# EAGLE design sdo_to_quiic_qt (EAGLE 9.5.2)
COMPANY: ADAFRUIT INDUSTRIES; DRAWN: KTOWN; REV: A
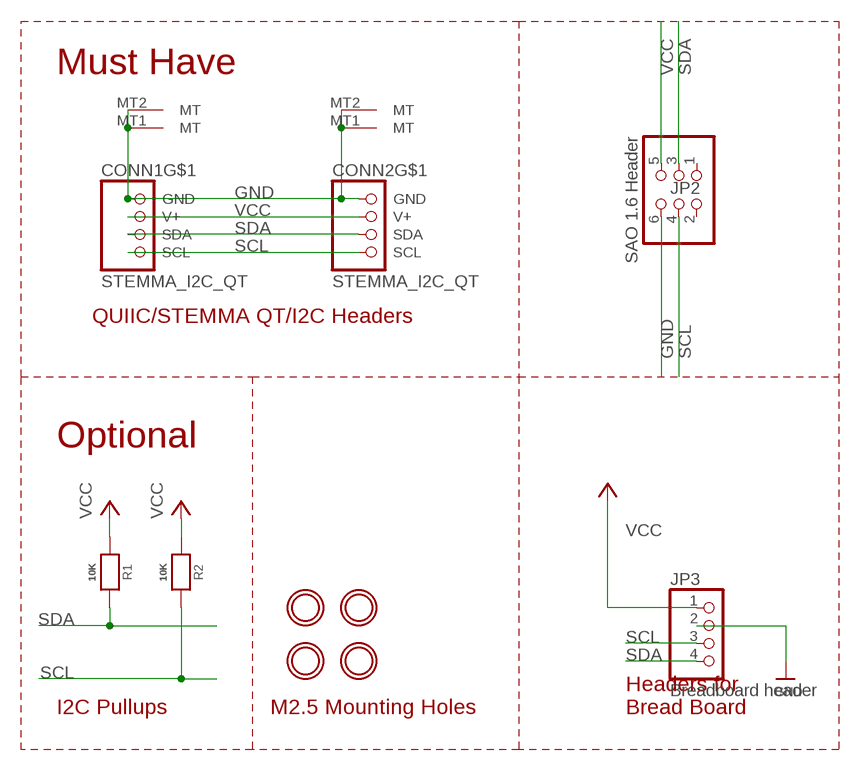
[diagram p0: schematic, sheet 1]

## Parts
CONN1  STEMMA_I2C_QT  [JST_SH4]
CONN2  STEMMA_I2C_QT  [JST_SH4]
JP2  SAO 1.6 Header  HEADER-2X3  [2X03_ROUND_70MIL]
JP3  Breadboard header  HEADER-1X4ROUND  [1X04_ROUND]
R1  10K  RESISTOR0805_NOOUTLINE  [0805-NO]
R2  10K  RESISTOR0805_NOOUTLINE  [0805-NO]
U$1  MOUNTINGHOLE2.5  [MOUNTINGHOLE_2.5_PLATED]
U$17  MOUNTINGHOLE2.5  [MOUNTINGHOLE_2.5_PLATED]
U$19  MOUNTINGHOLE2.5  [MOUNTINGHOLE_2.5_PLATED]
U$21  MOUNTINGHOLE2.5  [MOUNTINGHOLE_2.5_PLATED]

## Nets
GND [highpower]: CONN1.1(GND) CONN1.MT1(MT) CONN1.MT2(MT) CONN2.1(GND) CONN2.MT1(MT) CONN2.MT2(MT) JP2.6 JP3.2
SCL: CONN1.4(SCL) CONN2.4(SCL) JP2.4 JP3.3 R2.2
SDA: CONN1.3(SDA) CONN2.3(SDA) JP2.3 JP3.4 R1.2
VCC [highpower]: CONN1.2(V+) CONN2.2(V+) JP2.5 JP3.1 R1.1 R2.1
Unconnected: JP2.1 JP2.2

## Notes on the sheet
- Must Have
- QUIIC/STEMMA QT/I2C Headers
- Optional
- I2C Pullups | M2.5 Mounting Holes
- Headers for
  Bread Board

## Library data of the parts
CONN1 CONN2 = microbuilder:STEMMA_I2C
JP2 = microbuilder:HEADER-2X3: PIN HEADER
JP3 = microbuilder:HEADER-1X4: PIN HEADER
R1 R2 = microbuilder:RESISTOR: Resistors For new designs, use the packages preceded by an '_' character since they are more reliable: The following footprints should be used on most boards: _0402 - Standard footprint for regular board layouts _0603 - Standard footprint for regular board layouts _0805 - Standard footprint for regular board layouts _1206 - Standard footprint for regular board layouts For extremely tight-pitch boards where space is at a premium, the following 'micro-pitch' footprints can be used (smaller pads, no silkscreen outline, etc.): _0402MP - Micro-pitch footprint for very dense/compact boards _0603MP - Micro-pitch footprint for very dense/compact boards _0805MP - Micro-pitch footprint for very dense/compact boards _1206MP - Micro-pitch footprint for very dense/compact boards
U$1 U$17 U$19 U$21 = microbuilder:MOUNTINGHOLE: Mounting Hole For #2 screws (0.086"/2.18mm width, 0.094"/2.4mm hole) use 2.5mm; BOM: EXCLUDE

## Net classes
1 highpower: width 0.305 mm, drill 0.483 mm
2 lowpower: width 0.254 mm, drill 0.483 mm

## Board
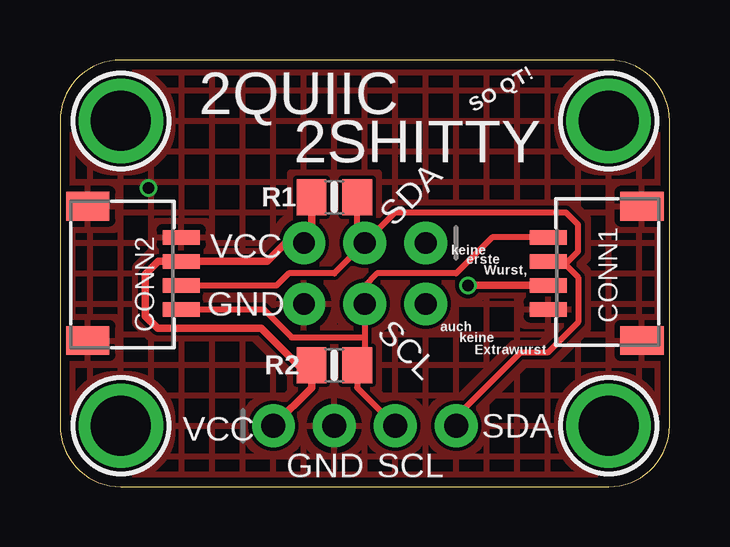
[diagram p1: board, top side]
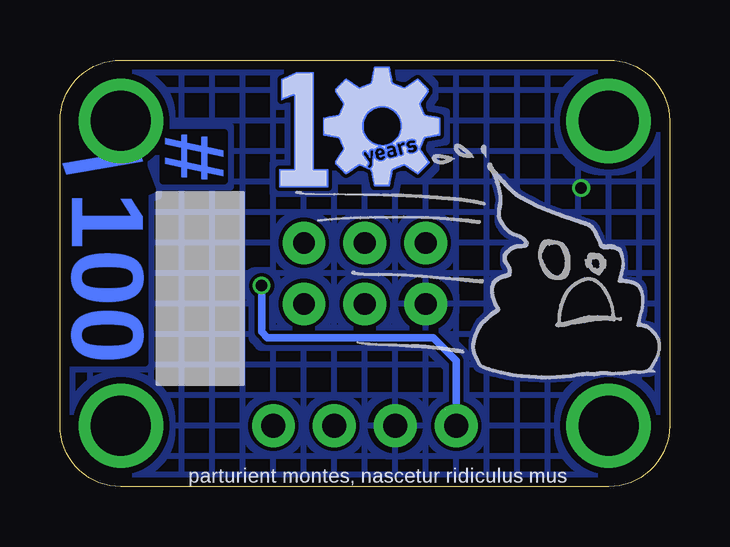
[diagram p2: board, bottom side, seen from below]

Size 25.4 x 17.78 mm. Coordinates in mm from the lower left corner, seen from the top.
Outline: 0,15.24 0,2.54 arc90 2.54,0 22.86,0 arc90 25.4,2.54 25.4,15.24 arc90 22.86,17.78 2.54,17.78 arc90 0,15.24
Copper layers (1*16): Top 0.035559375mm / dielectric 1.6mm / Bottom 0.035559375mm
Design rules "oshpark-2layer-tented": minimum track width 6mil, minimum drill 10mil, track to track 6mil, track to pad 6mil, pad to pad 6mil, via to via 6mil, smd to smd 6mil, copper to edge 15mil, drill to drill 6mil, minimum pad ring 5mil, minimum via ring 5mil, stop-mask expansion 2.5mil, vias tented up to drill 20mil, thermal gap 10mil
bRestrict: area 5,4.6 to 5,4.6; area 5,4.6 to 5.1,4.6; area 5.1,4.6 to 5.1,4.6; area 5.1,4.6 to 5.1,4.6; area 5.2,4.6 to 5.2,4.6; area 4.8,4.6 to 5.3,4.6; area 4.7,4.6 to 4.7,4.6; area 4.7,4.6 to 4.7,4.6; area 4.7,4.6 to 5.3,4.6; area 5.3,4.6 to 5.5,4.6; area 4.6,4.6 to 4.6,4.6; area 4.6,4.6 to 5.6,4.6; 2133 more areas

### Footprints (pad centres in the part's own frame; a part is rotated, then mirrored left to right if it is on the bottom)
JST_SH4 = smd 0.6 x 1.55: 1 -1.5,2.514; 2 -0.5,2.514; 3 0.5,2.514; 4 1.5,2.514 | smd 1.2 x 1.8: MT1 -2.8,-1.386; MT2 2.8,-1.386
2X03_ROUND_70MIL = drill 0.9 pad 1.778: 1 -2.54,-1.27; 2 -2.54,1.27; 3 0,-1.27; 4 0,1.27; 5 2.54,-1.27; 6 2.54,1.27
1X04_ROUND = drill 1 pad 1.778: 1 -3.81,0; 2 -1.27,0; 3 1.27,0; 4 3.81,0
0805-NO = smd 1.24 x 1.5: 1 -0.95,0; 2 0.95,0
MOUNTINGHOLE_2.5_PLATED = drill 2.5 pad 3.2: P$1 0,0

### Placement (x,y rotation side)
CONN1  22.86,8.89 90 top
CONN2  2.54,8.89 270 top
JP2  12.7,8.89 180 top
JP3  12.7,2.54 0 top
R1  11.43,12.06 0 top
R2  11.43,5.06 0 top
U$1  2.54,15.24 0 top
U$17  22.86,15.24 0 top
U$19  2.54,2.54 0 top
U$21  22.86,2.54 0 top

### Tracks (layer width: path | path; a pad name or v marks a point on that pad's centre or on a via)
GND  (via drill 0.48)
  other vias: 3.68,12.45
  pour Top (hatched): 0,17.78 25.4,17.78 25.4,0 0,0
  pour Bottom (hatched): 25.4,15.24 25.4,2.54 arc-90 22.86,0 2.54,0 arc-90 0,2.54 0,15.24 arc-90 2.54,17.78 22.86,17.78 arc-90
SCL
  Top 0.254: 12.7,6.22 JP2.4 12.7,8.38 13.21,8.89 16.51,8.89 18.01,10.39 CONN1.4 | 12.7,6.22 12.7,5.27 R2.2 12.38,4.13 JP3.3 | CONN2.4 8.48,7.39 9.65,6.22 12.7,6.22
SDA
  Top 0.254: JP3.4 16.51,2.92 19.18,5.59 20.32,5.59 21.59,6.86 21.59,8.72 20.92,9.39 CONN1.3 21.17,9.39 21.59,9.81 21.59,10.92 21.08,11.43 13.97,11.43 JP2.3 | JP2.3 11.43,8.89 9.53,8.89 9.02,8.38 5.06,8.38 CONN2.3 | JP2.3 12.38,10.48 R1.2
VCC  (via drill 0.48)
  Top 0.305: JP3.1 10.48,4.13 R2.1 10.03,4.95 8.38,6.6 4.06,6.6 3.56,7.11 3.56,8.85 4.09,9.39 CONN2.2 8.63,9.39 9.4,10.16 JP2.5 10.48,10.48 R1.1 | v17,8.38 v17.01,8.39 CONN1.2
  Bottom 0.305: JP3.1 8.89,5.25 9.86,6.22 16.76,6.22 17,6.46 v17,8.38
(copper drawn outside any net)
  shapes: Bottom area x2630

### Text on the board
Bottom: # | / | 100
tPlace: 2QUIIC | SO QT! | 2SHITTY | SDA | VCC | keine | erste | Wurst, | GND | SCL | auch | keine | Extrawurst | SDA | VCC | GND | SCL
bPlace: parturient montes, nascetur ridiculus mus
bStop: # | / | 100